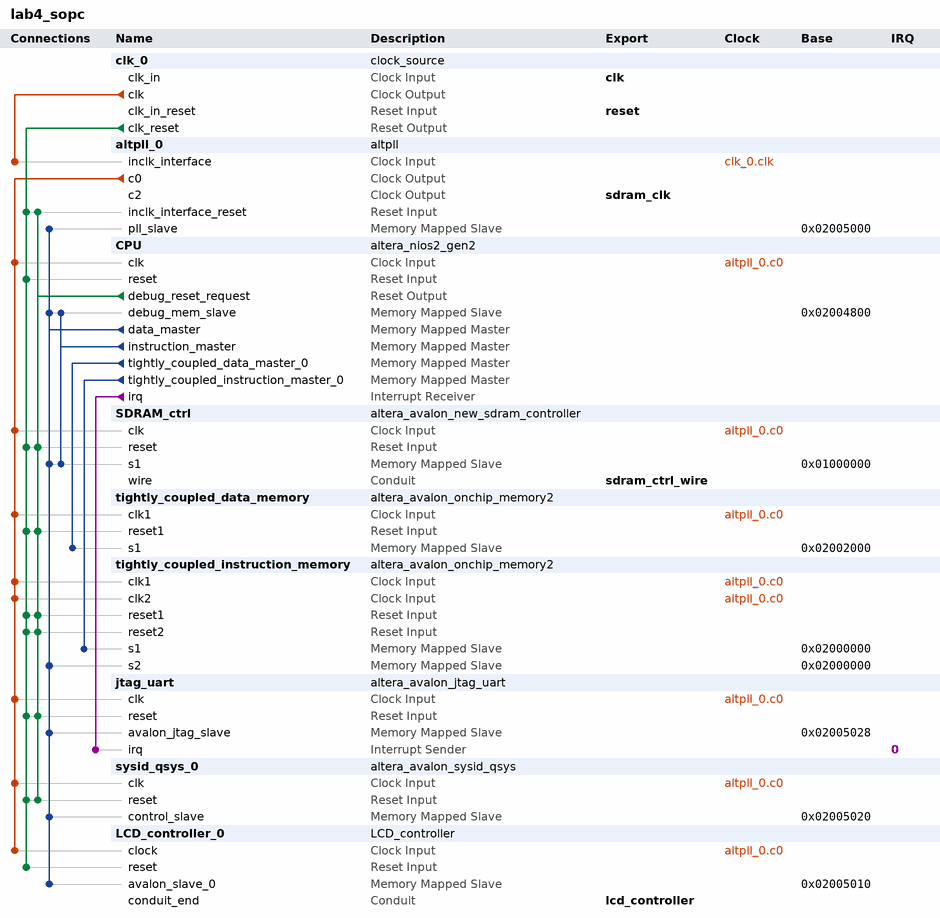
[diagram p0: system contents]
# Platform Designer (Qsys) system lab4_sopc, Cyclone IV E EP4CE30F23A7
# Parameters at their usual value, and those the tool derives, are not listed.
package require -exact qsys 18.1
create_system lab4_sopc
set_project_property DEVICE_FAMILY {Cyclone IV E}
set_project_property DEVICE EP4CE30F23A7

add_instance clk_0 clock_source 18.1
set_instance_parameter_value clk_0 clockFrequency 50000000

add_instance altpll_0 altpll 18.1
set_instance_parameter_value altpll_0 CLK0_DIVIDE_BY 1
set_instance_parameter_value altpll_0 CLK0_MULTIPLY_BY 1
set_instance_parameter_value altpll_0 CLK2_DIVIDE_BY 1
set_instance_parameter_value altpll_0 CLK2_DUTY_CYCLE 50
set_instance_parameter_value altpll_0 CLK2_MULTIPLY_BY 1
set_instance_parameter_value altpll_0 CLK2_PHASE_SHIFT 0
set_instance_parameter_value altpll_0 INCLK0_INPUT_FREQUENCY 20000
set_instance_parameter_value altpll_0 PORT_ARESET PORT_UNUSED
set_instance_parameter_value altpll_0 PORT_LOCKED PORT_UNUSED
set_instance_parameter_value altpll_0 PORT_clk1 PORT_UNUSED
set_instance_parameter_value altpll_0 PORT_clk2 PORT_USED
set_instance_parameter_value altpll_0 PORT_clk3 PORT_UNUSED

add_instance CPU altera_nios2_gen2 18.1
set_instance_parameter_value CPU dcache_numTCDM 1
set_instance_parameter_value CPU dcache_size 2048
set_instance_parameter_value CPU exceptionSlave SDRAM_ctrl.s1
set_instance_parameter_value CPU icache_numTCIM 1
set_instance_parameter_value CPU icache_size 4096
set_instance_parameter_value CPU impl Fast
set_instance_parameter_value CPU resetSlave SDRAM_ctrl.s1

add_instance SDRAM_ctrl altera_avalon_new_sdram_controller 18.1
set_instance_parameter_value SDRAM_ctrl TAC 5.5
set_instance_parameter_value SDRAM_ctrl TRCD 20.0
set_instance_parameter_value SDRAM_ctrl TRP 20.0
set_instance_parameter_value SDRAM_ctrl casLatency 3
set_instance_parameter_value SDRAM_ctrl columnWidth 9
set_instance_parameter_value SDRAM_ctrl dataWidth 16
set_instance_parameter_value SDRAM_ctrl generateSimulationModel false
set_instance_parameter_value SDRAM_ctrl model single_Micron_MT48LC4M32B2_7_chip
set_instance_parameter_value SDRAM_ctrl numberOfBanks 4
set_instance_parameter_value SDRAM_ctrl numberOfChipSelects 1
set_instance_parameter_value SDRAM_ctrl powerUpDelay 100.0
set_instance_parameter_value SDRAM_ctrl refreshPeriod 15.625
set_instance_parameter_value SDRAM_ctrl rowWidth 12

add_instance tightly_coupled_data_memory altera_avalon_onchip_memory2 18.1
set_instance_parameter_value tightly_coupled_data_memory dataWidth 32
set_instance_parameter_value tightly_coupled_data_memory dualPort false
set_instance_parameter_value tightly_coupled_data_memory initMemContent false
set_instance_parameter_value tightly_coupled_data_memory initializationFileName onchip_mem.hex
set_instance_parameter_value tightly_coupled_data_memory memorySize 8192

add_instance tightly_coupled_instruction_memory altera_avalon_onchip_memory2 18.1
set_instance_parameter_value tightly_coupled_instruction_memory dataWidth 32
set_instance_parameter_value tightly_coupled_instruction_memory dualPort true
set_instance_parameter_value tightly_coupled_instruction_memory initMemContent false
set_instance_parameter_value tightly_coupled_instruction_memory initializationFileName onchip_mem.hex
set_instance_parameter_value tightly_coupled_instruction_memory memorySize 8192

add_instance jtag_uart altera_avalon_jtag_uart 18.1
set_instance_parameter_value jtag_uart simInteractiveOptions NO_INTERACTIVE_WINDOWS

add_instance sysid_qsys_0 altera_avalon_sysid_qsys 18.1
set_instance_parameter_value sysid_qsys_0 id 12213761

add_instance LCD_controller_0 LCD_controller 1.0

# connections
add_connection altpll_0.c0 CPU.clk clock
add_connection altpll_0.c0 jtag_uart.clk clock
add_connection altpll_0.c0 LCD_controller_0.clock clock
add_connection altpll_0.c0 SDRAM_ctrl.clk clock
add_connection altpll_0.c0 sysid_qsys_0.clk clock
add_connection altpll_0.c0 tightly_coupled_data_memory.clk1 clock
add_connection altpll_0.c0 tightly_coupled_instruction_memory.clk1 clock
add_connection altpll_0.c0 tightly_coupled_instruction_memory.clk2 clock
add_connection clk_0.clk altpll_0.inclk_interface clock
add_connection clk_0.clk_reset altpll_0.inclk_interface_reset reset
add_connection clk_0.clk_reset CPU.reset reset
add_connection clk_0.clk_reset jtag_uart.reset reset
add_connection clk_0.clk_reset LCD_controller_0.reset reset
add_connection clk_0.clk_reset SDRAM_ctrl.reset reset
add_connection clk_0.clk_reset sysid_qsys_0.reset reset
add_connection clk_0.clk_reset tightly_coupled_data_memory.reset1 reset
add_connection clk_0.clk_reset tightly_coupled_instruction_memory.reset1 reset
add_connection clk_0.clk_reset tightly_coupled_instruction_memory.reset2 reset
add_connection CPU.debug_reset_request altpll_0.inclk_interface_reset reset
add_connection CPU.debug_reset_request jtag_uart.reset reset
add_connection CPU.debug_reset_request SDRAM_ctrl.reset reset
add_connection CPU.debug_reset_request sysid_qsys_0.reset reset
add_connection CPU.debug_reset_request tightly_coupled_data_memory.reset1 reset
add_connection CPU.debug_reset_request tightly_coupled_instruction_memory.reset1 reset
add_connection CPU.debug_reset_request tightly_coupled_instruction_memory.reset2 reset
add_connection CPU.data_master altpll_0.pll_slave avalon
set_connection_parameter_value CPU.data_master/altpll_0.pll_slave baseAddress 0x02005000
add_connection CPU.data_master CPU.debug_mem_slave avalon
set_connection_parameter_value CPU.data_master/CPU.debug_mem_slave baseAddress 0x02004800
add_connection CPU.data_master jtag_uart.avalon_jtag_slave avalon
set_connection_parameter_value CPU.data_master/jtag_uart.avalon_jtag_slave baseAddress 0x02005028
add_connection CPU.data_master LCD_controller_0.avalon_slave_0 avalon
set_connection_parameter_value CPU.data_master/LCD_controller_0.avalon_slave_0 baseAddress 0x02005010
add_connection CPU.data_master SDRAM_ctrl.s1 avalon
set_connection_parameter_value CPU.data_master/SDRAM_ctrl.s1 baseAddress 0x01000000
add_connection CPU.data_master sysid_qsys_0.control_slave avalon
set_connection_parameter_value CPU.data_master/sysid_qsys_0.control_slave baseAddress 0x02005020
add_connection CPU.data_master tightly_coupled_instruction_memory.s2 avalon
set_connection_parameter_value CPU.data_master/tightly_coupled_instruction_memory.s2 baseAddress 0x02000000
add_connection CPU.instruction_master CPU.debug_mem_slave avalon
set_connection_parameter_value CPU.instruction_master/CPU.debug_mem_slave baseAddress 0x02004800
add_connection CPU.instruction_master SDRAM_ctrl.s1 avalon
set_connection_parameter_value CPU.instruction_master/SDRAM_ctrl.s1 baseAddress 0x01000000
add_connection CPU.tightly_coupled_data_master_0 tightly_coupled_data_memory.s1 avalon
set_connection_parameter_value CPU.tightly_coupled_data_master_0/tightly_coupled_data_memory.s1 baseAddress 0x02002000
add_connection CPU.tightly_coupled_instruction_master_0 tightly_coupled_instruction_memory.s1 avalon
set_connection_parameter_value CPU.tightly_coupled_instruction_master_0/tightly_coupled_instruction_memory.s1 baseAddress 0x02000000
add_connection CPU.irq jtag_uart.irq interrupt
set_connection_parameter_value CPU.irq/jtag_uart.irq irqNumber 0

# exported interfaces
add_interface clk clock sink
set_interface_property clk EXPORT_OF clk_0.clk_in
add_interface lcd_controller conduit end
set_interface_property lcd_controller EXPORT_OF LCD_controller_0.conduit_end
add_interface reset reset sink
set_interface_property reset EXPORT_OF clk_0.clk_in_reset
add_interface sdram_clk clock source
set_interface_property sdram_clk EXPORT_OF altpll_0.c2
add_interface sdram_ctrl_wire conduit end
set_interface_property sdram_ctrl_wire EXPORT_OF SDRAM_ctrl.wire

set_interconnect_requirement {$system} qsys_mm.clockCrossingAdapter HANDSHAKE
set_interconnect_requirement {$system} qsys_mm.enableEccProtection FALSE
set_interconnect_requirement {$system} qsys_mm.insertDefaultSlave FALSE
set_interconnect_requirement {$system} qsys_mm.maxAdditionalLatency 1

save_system lab4_sopc.qsys
